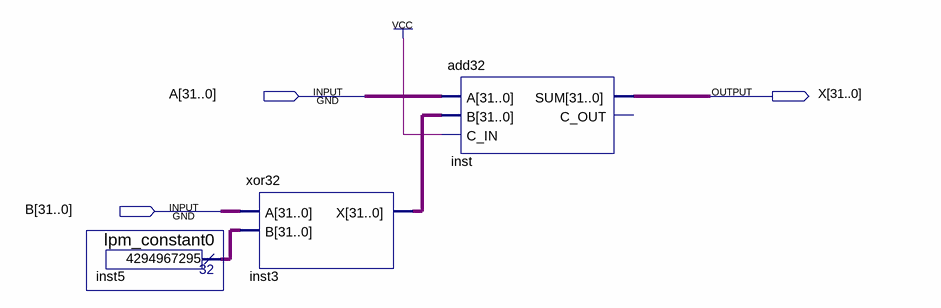
[diagram p0: schematic sheet]
// Quartus schematic sub32.bdf as structural Verilog: 3 symbols, 3 pins
module sub32 (
  input  [31:0] A,
  input  [31:0] B,
  output [31:0] X
);

  wire [31:0] inst3_x, inst5_result;

  lpm_constant0 inst5 (.result(inst5_result));
  xor32 inst3 (.A(B), .B(inst5_result), .X(inst3_x));
  add32 inst (.A(A), .B(inst3_x), .C_IN(1'b1), .SUM(X));  // open: C_OUT
endmodule
